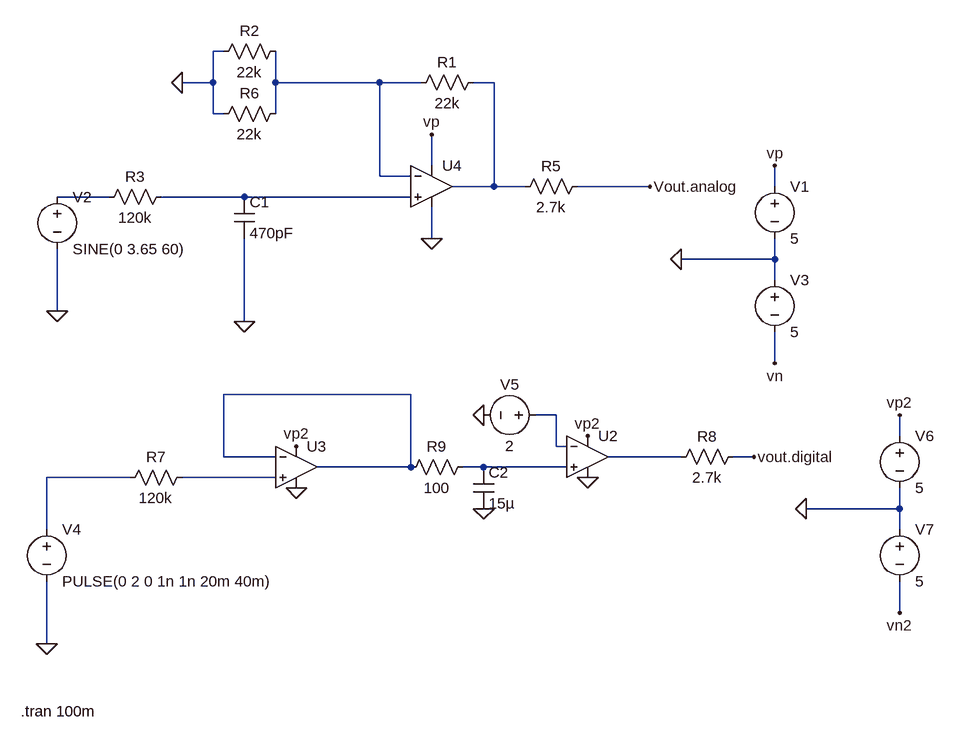
[diagram p0: schematic S-asemaprojekti_LTspice.asc]
S-asemaprojekti_LTspice.asc, the LTspice schematic file:
Version 4
SHEET 1 3448 1352
WIRE 656 224 640 224
WIRE 640 272 640 224
WIRE 640 272 592 272
WIRE 736 272 736 224
WIRE 896 272 736 272
WIRE 960 272 896 272
WIRE 1072 272 1040 272
WIRE 640 320 640 272
WIRE 656 320 640 320
WIRE 736 320 736 272
WIRE 976 400 976 352
WIRE 896 416 896 272
WIRE 944 416 896 416
WIRE 1072 432 1072 272
WIRE 1072 432 1008 432
WIRE 1120 432 1072 432
WIRE 1312 432 1200 432
WIRE 1504 432 1504 400
WIRE 480 448 400 448
WIRE 688 448 560 448
WIRE 944 448 688 448
WIRE 976 512 976 464
WIRE 1504 544 1504 512
WIRE 1504 544 1360 544
WIRE 1504 576 1504 544
WIRE 400 624 400 528
WIRE 688 640 688 512
WIRE 1504 704 1504 656
WIRE 944 752 656 752
WIRE 1168 784 1136 784
WIRE 1696 816 1696 784
WIRE 1168 832 1168 784
WIRE 1184 832 1168 832
WIRE 656 848 656 752
WIRE 736 848 656 848
WIRE 1360 848 1248 848
WIRE 1472 848 1440 848
WIRE 944 864 944 752
WIRE 944 864 800 864
WIRE 1056 864 1024 864
WIRE 1184 864 1056 864
WIRE 512 880 384 880
WIRE 736 880 592 880
WIRE 1696 928 1696 896
WIRE 1696 928 1552 928
WIRE 384 960 384 880
WIRE 1696 960 1696 928
WIRE 1696 1088 1696 1040
WIRE 384 1136 384 1040
FLAG 1360 544 0
FLAG 1504 704 vn
FLAG 1504 400 vp
FLAG 592 272 0
FLAG 768 896 0
FLAG 768 832 vp2
FLAG 1056 784 0
FLAG 1216 816 vp2
FLAG 1056 928 0
FLAG 1216 880 0
FLAG 400 624 0
FLAG 688 640 0
FLAG 1312 432 Vout.analog
FLAG 1472 848 vout.digital
FLAG 1696 1088 vn2
FLAG 1696 784 vp2
FLAG 1552 928 0
FLAG 976 512 0
FLAG 976 352 vp
FLAG 384 1136 0
SYMBOL voltage 400 432 R0
WINDOW 123 0 0 Left 0
WINDOW 39 0 0 Left 0
SYMATTR InstName V2
SYMATTR Value SINE(0 3.65 60)
SYMBOL res 1056 256 R90
WINDOW 0 0 56 VBottom 2
WINDOW 3 32 56 VTop 2
SYMATTR InstName R1
SYMATTR Value 22k
SYMBOL voltage 1504 416 R0
SYMATTR InstName V1
SYMATTR Value 5
SYMBOL voltage 1504 560 R0
SYMATTR InstName V3
SYMATTR Value 5
SYMBOL res 576 432 R90
WINDOW 0 0 56 VBottom 2
WINDOW 3 32 56 VTop 2
SYMATTR InstName R3
SYMATTR Value 120k
SYMBOL Res 1216 416 R90
WINDOW 0 0 56 VBottom 2
WINDOW 3 32 56 VTop 2
SYMATTR InstName R5
SYMATTR Value 2.7k
SYMBOL Res 752 208 R90
WINDOW 0 0 56 VBottom 2
WINDOW 3 32 56 VTop 2
SYMATTR InstName R2
SYMATTR Value 22k
SYMBOL Res 752 304 R90
WINDOW 0 0 56 VBottom 2
WINDOW 3 32 56 VTop 2
SYMATTR InstName R6
SYMATTR Value 22k
SYMBOL cap 672 448 R0
SYMATTR InstName C1
SYMATTR Value 470pF
SYMBOL voltage 384 944 R0
WINDOW 123 0 0 Left 0
WINDOW 39 0 0 Left 0
SYMATTR InstName V4
SYMATTR Value PULSE(0 2 0 1n 1n 20m 40m)
SYMBOL res 608 864 R90
WINDOW 0 0 56 VBottom 2
WINDOW 3 32 56 VTop 2
SYMATTR InstName R7
SYMATTR Value 120k
SYMBOL Res 1456 832 R90
WINDOW 0 0 56 VBottom 2
WINDOW 3 32 56 VTop 2
SYMATTR InstName R8
SYMATTR Value 2.7k
SYMBOL OpAmps\\UniversalOpAmp2 768 864 R0
SYMATTR InstName U3
SYMBOL res 1040 848 R90
WINDOW 0 0 56 VBottom 2
WINDOW 3 32 56 VTop 2
SYMATTR InstName R9
SYMATTR Value 100
SYMBOL cap 1040 864 R0
SYMATTR InstName C2
SYMATTR Value 15µ
SYMBOL voltage 1152 784 R90
WINDOW 0 -32 56 VBottom 2
WINDOW 3 32 56 VTop 2
SYMATTR InstName V5
SYMATTR Value 2
SYMBOL OpAmps\\UniversalOpAmp2 1216 848 R0
SYMATTR InstName U2
SYMBOL voltage 1696 800 R0
SYMATTR InstName V6
SYMATTR Value 5
SYMBOL voltage 1696 944 R0
SYMATTR InstName V7
SYMATTR Value 5
SYMBOL OpAmps\\UniversalOpAmp2 976 432 R0
SYMATTR InstName U4
TEXT 344 1240 Left 2 !.tran 100m

The netlist it stands for:
* S-asemaprojekti_LTspice.asc
V2 N003 0 SINE(0 3.65 60)
R1 N002 N001 22k
V1 vp 0 5
V3 0 vn 5
R3 N004 N003 120k
R5 Vout.analog N002 2.7k
R2 N001 0 22k
R6 N001 0 22k
C1 N004 0 470pF
V4 N009 0 PULSE(0 2 0 1n 1n 20m 40m)
R7 N010 N009 120k
R8 vout.digital N007 2.7k
XU3 N010 N005 vp2 0 N005 level2 Avol=1Meg GBW=10Meg Slew=10Meg Ilimit=25m Rail=0 Vos=0 En=0 Enk=0 In=0 Ink=0 Rin=500Meg  ; pins In+ In- V+ V- OUT
R9 N008 N005 100
C2 N008 0 15µ
V5 N006 0 2
XU2 N008 N006 vp2 0 N007 level2 Avol=1Meg GBW=10Meg Slew=10Meg Ilimit=25m Rail=0 Vos=0 En=0 Enk=0 In=0 Ink=0 Rin=500Meg  ; pins In+ In- V+ V- OUT
V6 vp2 0 5
V7 0 vn2 5
XU4 N004 N001 vp 0 N002 level2 Avol=1Meg GBW=10Meg Slew=10Meg Ilimit=25m Rail=0 Vos=0 En=0 Enk=0 In=0 Ink=0 Rin=500Meg  ; pins In+ In- V+ V- OUT
.tran 100m
.lib UniversalOpAmp2.lib
.backanno
.end